# Altium schematic sheet 2_Safety_Relay.SchDoc
size A
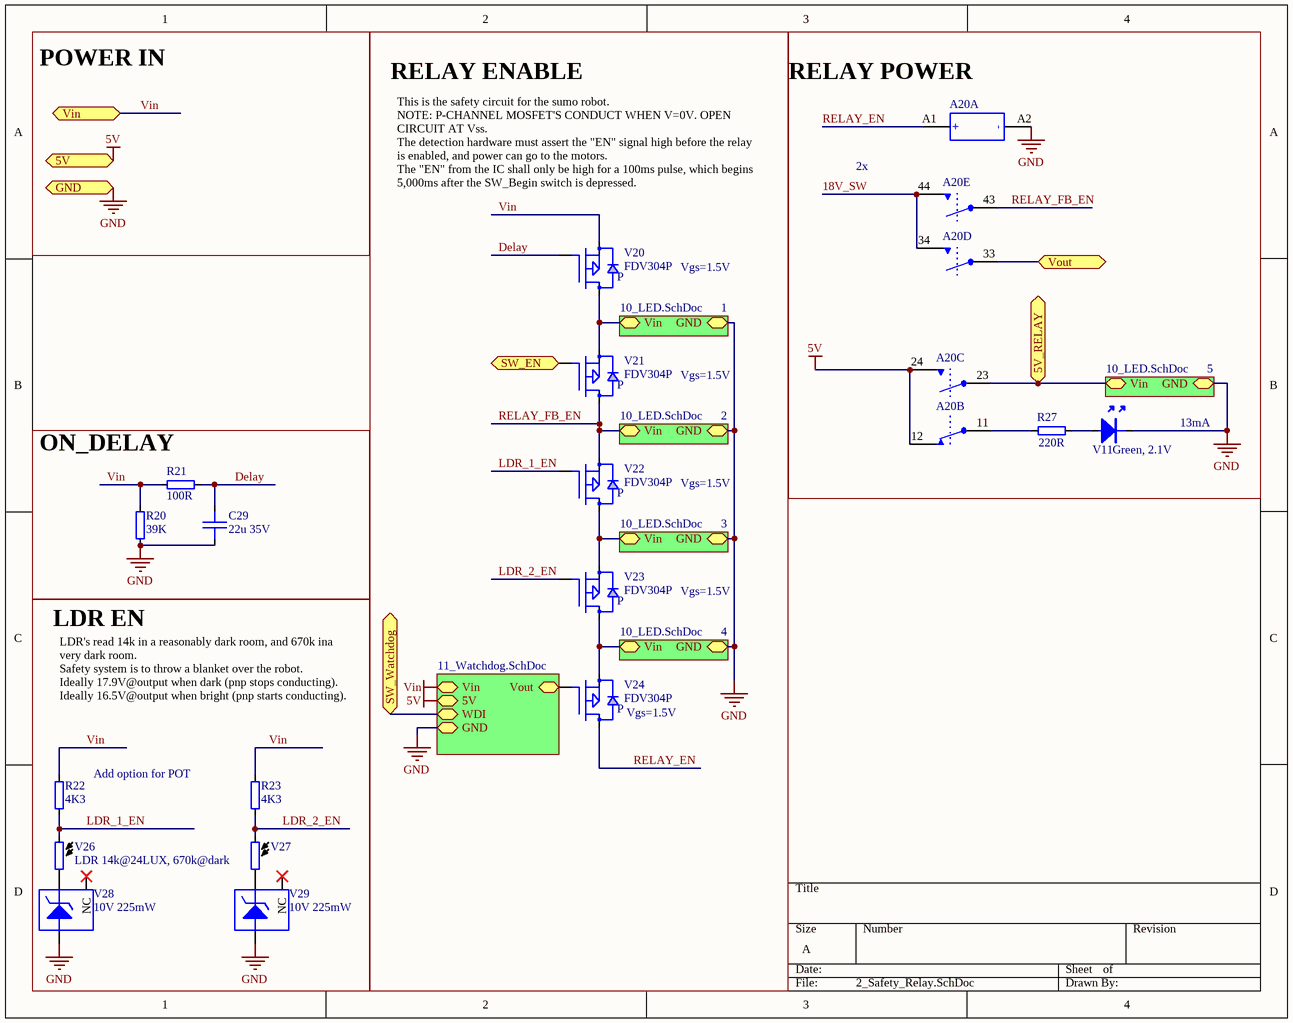
[diagram p0: 2_Safety_Relay.SchDoc]

## Parts
A20  RELAY SAFETY 4PST 8A 18V  [RELAY-BRUMFIELD-4PST-3NO-1NC]  (value not drawn)  (parts A,B,C,D,E of 5)
C29  22u 35V  [0805]
R20  39K  [0805]
R21  100R  [0805]
R22  4K3  [0603]
R23  4K3  [0603]
R27  220R  [1206]
V11  Green, 2.1V  [LED-0805]
V20  FDV304P  [SOT23]
V21  FDV304P  [SOT23]
V22  FDV304P  [SOT23]
V23  FDV304P  [SOT23]
V24  FDV304P  [SOT23]
V26  LDR 14k@24LUX, 670k@dark  [LDR_NSL-5112]
V27  LDR 14k@24LUX, 670k@dark  [LDR_NSL-5112]  (value not drawn)
V28  10V 225mW  [SOT23]
V29  10V 225mW  [SOT23]

## Blocks framed on the sheet
RELAY ENABLE: V20-V24
RELAY POWER: A20 R27 V11
ON_DELAY: C29 R20 R21
LDR EN: R22 R23 V26-V29

## Sub-sheets
1 = 10_LED.SchDoc: Vin, GND
2 = 10_LED.SchDoc: Vin, GND
3 = 10_LED.SchDoc: Vin, GND
4 = 10_LED.SchDoc: Vin, GND
5 = 10_LED.SchDoc: Vin, GND
? = 11_Watchdog.SchDoc: Vin, 5V, WDI, GND, Vout

## Ports
5V, 5V_RELAY, GND, SW_EN, SW_Watchdog, Vin, Vout

## Nets
5V: A20.12 A20.24 ; port 5V, sheet /5V
GND: A20.A2 C29.2 R20.1 V11.k V28.z(a) V29.z(a) ; port GND, sheet 5/GND, sheet 1/GND, sheet 2/GND, sheet 3/GND, sheet 4/GND, sheet /GND
Vin: R20.2 R21.1 R22.2 R23.2 V20.y(s) ; port Vin, sheet /Vin
5V_RELAY: A20.23 ; port 5V_RELAY, sheet 5/Vin
18V_SW: A20.34 A20.44
Delay: C29.1 R21.2 V20.z(gate)
LDR_1_EN: R22.1 V22.z(gate) V26.1
LDR_2_EN: R23.1 V23.z(gate) V27.1
RELAY_EN: A20.A1 V24.x(d)
RELAY_FB_EN: A20.43 V21.x(d) V22.y(s) ; sheet 2/Vin
SW_EN: V21.z(gate) ; port SW_EN
SW_Watchdog: port SW_Watchdog, sheet /WDI
Vout: A20.33 ; port Vout
NetA20_11: A20.11 R27.1
NetR27_2: R27.2 V11.a
NetV20_x: V20.x(d) V21.y(s) ; sheet 1/Vin
NetV22_x: V22.x(d) V23.y(s) ; sheet 3/Vin
NetV23_x: V23.x(d) V24.y(s) ; sheet 4/Vin
NetV24_z: V24.z(gate) ; sheet /Vout
NetV26_2: V26.2 V28.x(k)
NetV27_2: V27.2 V29.x(k)

Not connected (* = marked no-connect by the designer): V28 y(NC)*; V29 y(NC)*

## Notes on the sheet
- POWER IN
- This is the safety circuit for the sumo robot.
  NOTE: P-CHANNEL MOSFET'S CONDUCT WHEN V=0V. OPEN CIRCUIT AT Vss.
  The detection hardware must assert the "EN" signal high before the relay is enabled, and power can go to the motors.
  The "EN" from the IC shall only be high for a 100ms pulse, which begins 5,000ms after the SW_Begin switch is depressed.
- 2x
- Vgs=1.5V
- 13mA
- LDR's read 14k in a reasonably dark room, and 670k ina  very dark room.
  Safety system is to throw a blanket over the robot.
  Ideally 17.9V@output when dark (pnp stops conducting).
  Ideally 16.5V@output when bright (pnp starts conducting).
- Add option for POT
- (near V24) Vgs=1.5V
- (in symbol 5221) P
- (in symbol 9827, part A) -; +

## Library data of the parts
A20 = 9827: Safety Relay 4PST, 3NO 1 NC; Manufacturer: TE Connectivity Potter & Brumfield Relays; PartNumber: SR4M4018; IPN: 9827; Characteristics: 18VDC 405ohm  1250VAC/8A-Switching-load; Lead_Process_Compatible: Yes; SubmittedBy: zmze; DeviceRank: 2; Part Field 1: RELAY SAFETY 4PST 8A 18V; Part Field 2: TE Connectivity Potter & Brumfield Relays SR4M4018; ComponentLink2Description: Compliant; Altium_Comment_Old: RELAY SAFETY 4PST 8A 18V; Altium_Comment: RELAY SAFETY 4PST 8A 18V; Symbol: RELAY-4PST-3A1B; LastChanged: 27/05/16 08:10:39; Supplier1: Digikey; Supplier1_PartNumber: PB1304-ND; IPN_Search: 9827; OrderNumber: SR4M4018; PartType: PCB; ComponentLink1Description: TE Connectivity Potter & Brumfield Relays_SR4M4018_ENG_DS_SR4_DXM_0415.pdf; ComponentLink1URL: http://ecad.vsl.com.au/apps/BomGen/Data/rel/datasheets/TE Connectivity Potter & Brumfield Relays/TE Connectivity Potter & Brumfield Relays_SR4M4018_ENG_DS_SR4_DXM_0415.pdf
C29 = 8018: Capacitor; Part Field 1: CAP CER 22u 20% 35V X5R 0805 RoHS; Manufacturer: TDK; PartNumber: C2012X5R1V226M125AC; IPN: 8018; EndOfLife: Active EOL:Jul 2028; Characteristics: -55..85C; Lead_Process_Compatible: Yes; SubmittedBy: ptk; DeviceRank: 2; Part Field 2: TDK C2012X5R1V226M125AC; ComponentLink1Description: TDK_C2012X5R1V226M125AC_TDK multilayer ceramic caps.pdf; ComponentLink2Description: TDK_C2012X5R1V226M125AC_C2012X5R1V226M125AC.pdf; ComponentLink1URL: http://ecad.vsl.com.au/apps/BomGen/Data/rel/datasheets/TDK/TDK_C2012X5R1V226M125AC_TDK multilayer ceramic caps.pdf; ComponentLink2URL: http://ecad.vsl.com.au/apps/BomGen/Data/rel/rohs_compliance/new_certificates/TDK_C2012X5R1V226M125AC_C2012X5R1V226M125AC.pdf; Altium_Comment_Old: CAP CER 22u 20% 35V X5R 0805 RoHS; Altium_Comment: 22u 35V; Symbol: CAP; LastChanged: 20/08/15 08:08:22; Supplier1: DigiKey; Supplier1_PartNumber: 445-14428-1-ND; IPN_Search: 8018; OrderNumber: C2012X5R1V226M125AC; PartType: PCB; CheckedBy: pfu
R20 = 3712: Resistor; Part Field 1: RES 39K 1% 125mW 0805 RoHS; Manufacturer: Phycomp; PartNumber: RC0805FR-0739KL; IPN: 3712; EndOfLife: Active EOL:Jan 2023; Characteristics: 100ppm/C -55..+155C U=150Vrms Reel=5000pcs; OrderNumber: 232273463903L; Lead_Process_Compatible: Yes; SubmittedBy: ART; DeviceRank: 2; Part Field 2: Phycomp RC0805FR-0739KL; ComponentLink1Description: Phycomp_RC0805series_DS.pdf; ComponentLink2Description: Phycomp_Generic_RCS.pdf; ComponentLink1URL: http://ecad.vsl.com.au/apps/BomGen/Data/rel/datasheets/new_parts/Phycomp_RC0805series_DS.pdf; ComponentLink2URL: http://ecad.vsl.com.au/apps/BomGen/Data/rel/rohs_compliance/new_certificates/Phycomp_Generic_RCS.pdf; Altium_Comment_Old: RES 39K 1% 125mW 0805 RoHS; Altium_Comment: 39K; Symbol: RES; Supplier1: Arrow; Supplier1_PartNumber: RC0805FR-0739KL; Supplier2: Xon; IPN_Search: 3712; PartType: PCB; CheckedBy: ART; Price_5000: M$0.003
R21 = 3650: Resistor; Part Field 1: RES 100R 1% 125mW 0805 RoHS; Manufacturer: Phycomp; PartNumber: RC0805FR-07100RL; IPN: 3650; EndOfLife: Active EOL:Jan 2023; Characteristics: 100ppm/C -55..+155C U=150Vrms Reel=5000pcs; OrderNumber: 232273461001L; Lead_Process_Compatible: Yes; SubmittedBy: ART; DeviceRank: 2; Part Field 2: Phycomp RC0805FR-07100RL; ComponentLink1Description: Phycomp_RC0805series_DS.pdf; ComponentLink2Description: Phycomp_Generic_RCS.pdf; ComponentLink1URL: http://ecad.vsl.com.au/apps/BomGen/Data/rel/datasheets/new_parts/Phycomp_RC0805series_DS.pdf; ComponentLink2URL: http://ecad.vsl.com.au/apps/BomGen/Data/rel/rohs_compliance/new_certificates/Phycomp_Generic_RCS.pdf; Altium_Comment_Old: RES 100R 1% 125mW 0805 RoHS; Altium_Comment: 100R; Symbol: RES; Supplier1: Arrow; Supplier1_PartNumber: RC0805FR-07100RL; Supplier2: Xon; IPN_Search: 3650; PartType: PCB; CheckedBy: ART; Price_5000: M$0.003
R22 R23 = 3520: Resistor; Part Field 1: RES 4K3 1% 100mW 0603 RoHS; Manufacturer: Phycomp; PartNumber: RC0603FR-074K3L; IPN: 3520; EndOfLife: Active EOL:Jan 2023; AltIPN1: 6663; AltMFG1: PANASONIC; AltPN1: ERJ3EKF4301V; Characteristics: 100ppm/C -55..+155C U=50Vrms Reel=5000pcs; OrderNumber: 232270464302L; Lead_Process_Compatible: Yes; SubmittedBy: ART; DeviceRank: 1; Part Field 2: Phycomp RC0603FR-074K3L; ComponentLink1Description: Phycomp_RC0603series_DS.pdf; ComponentLink2Description: Phycomp_Generic_RCS.pdf; ComponentLink1URL: http://ecad.vsl.com.au/apps/BomGen/Data/rel/datasheets/new_parts/Phycomp_RC0603series_DS.pdf; ComponentLink2URL: http://ecad.vsl.com.au/apps/BomGen/Data/rel/rohs_compliance/new_certificates/Phycomp_Generic_RCS.pdf; Altium_Comment_Old: RES 4K3 1% 100mW 0603 RoHS; Altium_Comment: 4K3; Symbol: RES; LastChanged: 28/11/07 14:44:00; AltDesc1: RES 4K3 1% 100mW 0603 RoHS; AltROHS1: pa003.pdf; AltEOL1: Active EOL:Jan 2023; Supplier1: Arrow; Supplier1_PartNumber: RC0603FR-074K3L; Supplier2: Xon; Supplier2_PartNumber: 232270464302L; IPN_Search: 3520; PartType: PCB; CheckedBy: ART; Price_5000: M$0.002
R27 = 3827: Resistor; Part Field 1: RES 220R 1% 250mW 1206 RoHS; Manufacturer: Phycomp; PartNumber: RC1206FR-07220RL; IPN: 3827; EndOfLife: Active EOL:Jan 2023; Characteristics: 100ppm/C -55..+155C U=150Vrms Reel=5000pcs; OrderNumber: 232272462201L; Lead_Process_Compatible: Yes; SubmittedBy: ART; DeviceRank: 2; Part Field 2: Phycomp RC1206FR-07220RL; ComponentLink1Description: Phycomp_RC1206series_DS.pdf; ComponentLink2Description: Phycomp_Generic_RCS.pdf; ComponentLink1URL: http://ecad.vsl.com.au/apps/BomGen/Data/rel/datasheets/new_parts/Phycomp_RC1206series_DS.pdf; ComponentLink2URL: http://ecad.vsl.com.au/apps/BomGen/Data/rel/rohs_compliance/new_certificates/Phycomp_Generic_RCS.pdf; Altium_Comment_Old: RES 220R 1% 250mW 1206 RoHS; Altium_Comment: 220R; Symbol: RES; Supplier1: Arrow; Supplier1_PartNumber: RC1206FR-07220RL; Supplier2: Xon; IPN_Search: 3827; PartType: PCB; CheckedBy: ART; Price_5000: M$0.004
V11 = 6313: LED; Part Field 1: LED GREEN 0805 ROHS; Manufacturer: Chicago Miniature Lighting; PartNumber: CMD17-21UGC/TR8; IPN: 6313; EndOfLife: Active EOL:Sep 2021; Characteristics: GREEN Intensity=15mcd Ta=-40..+85C; Lead_Process_Compatible: Yes; SubmittedBy: ZJXL; DeviceRank: 2; Part Field 2: Chicago Miniature Lighting CMD17-21UGC/TR8; ComponentLink1Description: 1-25.pdf; ComponentLink2Description: CMD17-21UGC_TR8 RoHS CoC.pdf; ComponentLink1URL: \\michelangelo\erg shared folder\ECAD\elecCAD\apps\BomGen\Data\rel\datasheets\new_parts\1-25.pdf; ComponentLink2URL: \\michelangelo\erg shared folder\ECAD\elecCAD\apps\BomGen\Data\rel\rohs_compliance\new_certificates\CMD17-21UGC_TR8 RoHS CoC.pdf; Altium_Comment_Old: LED GREEN 0805 ROHS; Altium_Comment: LED Green; Symbol: LED; LastChanged: 6/09/13 17:30:23; Supplier1: Mouser; Supplier1_PartNumber: 606-CMD17-21UGC; Supplier2: DIGIKEY; Supplier2_PartNumber: L62415CT-ND; IPN_Search: 6313; OrderNumber: CMD17-21UGC/TR8; PartType: PCB; Price: 0.279 USD; CheckedBy: SAA; Price_100: M$0.170; Price_1000: M$0.150; Price_5000: M$0.150
V20-V24 = 5221: MOSFET P CHANNEL GENERIC SOT23; Part Field 1: MOSFET P-CH FDV304P SOT23; Manufacturer: Fairchild; IPN: 5221; EndOfLife: Active EOL:Jul 2022; Characteristics: 25V 0.46A 1.5R Vgs=1.5V 150deg; Lead_Process_Compatible: Yes; SubmittedBy: KZB; DeviceRank: 2; Part Field 2: Fairchild FDV304P; ComponentLink1Description: Fairchild_FDV304P_DS.pdf; ComponentLink2Description: Fairchild_Generic_RCS.pdf; ComponentLink1URL: http://ecad.vsl.com.au/apps/BomGen/Data/rel/datasheets/new_parts/Fairchild_FDV304P_DS.pdf; ComponentLink2URL: http://ecad.vsl.com.au/apps/BomGen/Data/rel/rohs_compliance/new_certificates/Fairchild_Generic_RCS.pdf; Altium_Comment_Old: MOSFET P-CH FDV304P SOT23; Altium_Comment: FDV304P; Symbol: MOSFET-P-SOT23; PartNumber: FDV304P; LastChanged: 10/06/10 13:58:43; Supplier1: Digikey; Supplier1_PartNumber: FDV304PCT-ND; Supplier2: Farnell; Supplier2_PartNumber: 9846123; IPN_Search: 5221; OrderNumber: FDV304P; PartType: PCB; Price: 0.697; CheckedBy: AJR; Price_100: M$0.102; Price_1000: M$0.070; Price_5000: M$0.053
V26 V27 = 9828: LDR; Part Field 1: LDR Photocell, 14k@24LUX, 670k@dark; Manufacturer: Luna Optoelectronics; IPN: 9828; Characteristics: 550nm, 100vPk, -65...+75C, 50mW max,; Lead_Process_Compatible: Yes; SubmittedBy: zmze; DeviceRank: 2; Part Field 2: Luna Optoelectronics NSL-5112; ComponentLink1Description: Luna Optoelectronics_NSL-5112_NSL-5112.pdf; ComponentLink2Description: Non_compliant; ComponentLink1URL: http://ecad.vsl.com.au/apps/BomGen/Data/rel/datasheets/Luna Optoelectronics/Luna Optoelectronics_NSL-5112_NSL-5112.pdf; Altium_Comment_Old: LDR Photocell, 14k@24LUX, 670k@dark; Altium_Comment: LDR 14k@24LUX, 670k@dark; Symbol: LDR; PartNumber: NSL-5112; LastChanged: 27/05/16 08:14:08; Supplier1: Digikey; Supplier1_PartNumber: NSL-5112-ND; IPN_Search: 9828; OrderNumber: NSL-5112; PartType: PCB
V28 V29 = 6327: DIODE ZENER SOT23 a-z k-x nc-y; Part Field 1: DIODE ZENER 10V 5% 225mW SOT23 RoHS; Manufacturer: ON Semi; PartNumber: BZX84C10LT1G; IPN: 6327; Characteristics: Vf=900mV Zzt=20R -65..+150C Reel=3000; Lead_Process_Compatible: Yes; SubmittedBy: VQD; DeviceRank: 2; Part Field 2: ON Semi BZX84C10LT1G; ComponentLink1Description: ON Semi_BZX84C10LT1G_BZX84 Series.pdf; ComponentLink2Description: ON Semi_BZX84C10LT1G_BZX84C10LT1G RoHS Cert.pdf; ComponentLink1URL: http://ecad.vsl.com.au/apps/BomGen/Data/rel/datasheets/ON Semi/ON Semi_BZX84C10LT1G_BZX84 Series.pdf; ComponentLink2URL: http://ecad.vsl.com.au/apps/BomGen/Data/rel/rohs_compliance/new_certificates/ON Semi_BZX84C10LT1G_BZX84C10LT1G RoHS Cert.pdf; Altium_Comment_Old: DIODE ZENER 10V 5% 225mW SOT23 RoHS; Altium_Comment: 10V 225mW; Symbol: ZENER-SOT23; LastChanged: 07/07/14 15:36:02; Supplier1: Digikey; Supplier1_PartNumber: BZX84C10LT1GOSTR-ND; IPN_Search: 6327; OrderNumber: BZX84C10LT1G; PartType: PCB; Price: 0.08990